# Altium schematic sheet LED_Matrix.SchDoc
size A; SheetNumber: 1; SheetTotal: 1
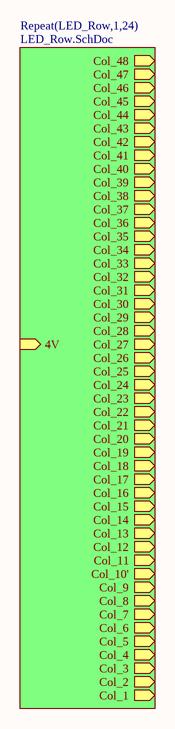
[diagram p0: LED_Matrix.SchDoc]

## Sub-sheets
Repeat(LED_Row,1,24) = LED_Row.SchDoc: Col_48 (out), Col_47 (out), Col_46 (out), Col_45 (out), Col_44 (out), Col_43 (out), Col_42 (out), Col_41 (out), Col_40 (out), Col_39 (out), Col_38 (out), Col_37 (out), Col_36 (out), Col_35 (out), Col_34 (out), Col_33 (out), Col_32 (out), Col_31 (out), Col_30 (out), Col_29 (out), Col_28 (out), Col_27 (out), Col_26 (out), Col_25 (out), Col_24 (out), Col_23 (out), Col_22 (out), Col_21 (out), Col_20 (out), Col_19 (out), Col_18 (out), Col_17 (out), Col_16 (out), Col_15 (out), Col_14 (out), Col_13 (out), Col_12 (out), Col_11 (out), Col_10' (out), Col_9 (out), Col_8 (out), Col_7 (out), Col_6 (out), Col_5 (out), Col_4 (out), Col_3 (out), Col_2 (out), Col_1 (out), 4V (in)